# EAGLE design Mosfet (EAGLE 9.3.0)
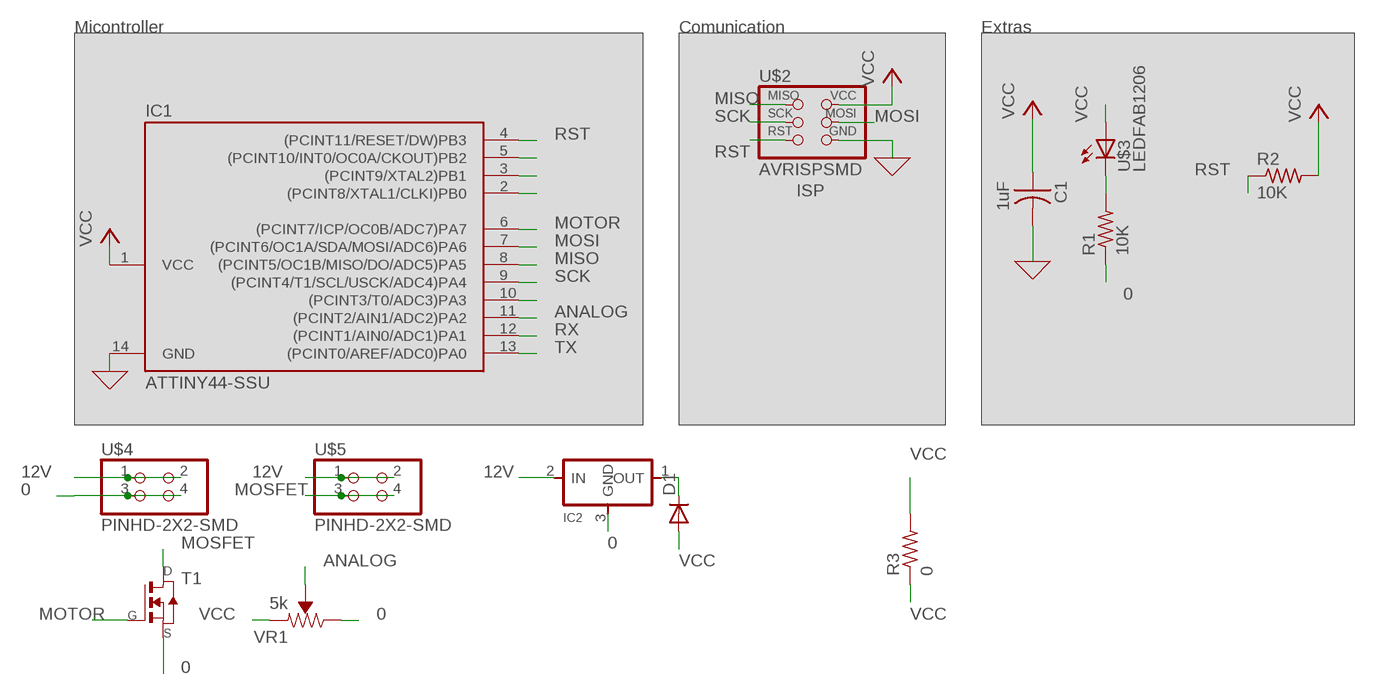
[diagram p0: schematic, sheet 1]

## Parts
C1  1uF  CAP-US1206FAB  [C1206FAB]
D1  DIODESOD123  [SOD123]
IC1  ATTINY44-SSU  [SOIC14]
IC2  REGULATORSOT23  [SOT23]
R1  10K  RES-US1206FAB  [R1206FAB]
R2  10K  RES-US1206FAB  [R1206FAB]
R3  0  RES-US1206FAB  [R1206FAB]
T1  NMOSFETSOT23  [SOT-23]
U$2  AVRISPSMD  [2X03SMD]
U$3  LEDFAB1206  [LED1206FAB]
U$4  PINHD-2X2-SMD  [2X02SMD]
U$5  PINHD-2X2-SMD  [2X02SMD]
VR1  5k  TRIMPOT-SMD-5MM-CLOSED-1/4W-20%  [TRIMPOT-SMD-5MM]

## Nets
0: C1.2 IC1.14(GND) IC2.3(GND) R1.1 T1.2(S) U$2.6(GND) U$4.3 U$4.4 VR1.C(CW) ; supply symbol labelled GND
12V: IC2.2(IN) U$4.1 U$4.2 U$5.1 U$5.2
ANALOG: IC1.11((PCINT2/AIN1/ADC2)PA2) VR1.B(WIPER)
MISO: IC1.8((PCINT5/OC1B/MISO/DO/ADC5)PA5) U$2.1(MISO)
MOSFET: T1.1(D) U$5.3 U$5.4
MOSI: IC1.7((PCINT6/OC1A/SDA/MOSI/ADC6)PA6) U$2.4(MOSI)
MOTOR: IC1.6((PCINT7/ICP/OC0B/ADC7)PA7) T1.3(G)
N$1: R1.2 U$3.2(C)
N$5: IC1.5((PCINT10/INT0/OC0A/CKOUT)PB2)
N$6: IC1.3((PCINT9/XTAL2)PB1)
N$7: IC1.2((PCINT8/XTAL1/CLKI)PB0)
N$11: D1.CATHODE(C) IC2.1(OUT)
N$12: IC1.10((PCINT3/T0/ADC3)PA3)
RST: IC1.4((PCINT11/RESET/DW)PB3) R2.1 U$2.5(RST)
RX: IC1.12((PCINT1/AIN0/ADC1)PA1)
SCK: IC1.9((PCINT4/T1/SCL/USCK/ADC4)PA4) U$2.3(SCK)
TX: IC1.13((PCINT0/AREF/ADC0)PA0)
VCC: C1.1 D1.ANODE(A) IC1.1(VCC) R2.2 R3.1 R3.2 U$2.2(VCC) U$3.1(A) VR1.A(CCW)

## Notes on the sheet
- Micontroller | Comunication | Extras
- ISP

## Library data of the parts
C1 = fab:CAP-US
D1 = fab:DIODE: DIODE high speed (Philips)
IC1 = fab:ATTINY44
IC2 = fab:REGULATOR
R1-R3 = fab:RES-US: Resistor (US Symbol) Variants with postfix FAB are widened to allow the routing of internal traces
T1 = fab:NMOSFET: MOS FET
U$2 = fab:AVRISP
U$3 = fab:LED: LED
U$4 U$5 = fab:PINHD-2X2-SMD
VR1 = SparkFun-Resistors:TRIMPOT: Trimming Potentiometer (Trimpot) Three-terminal potentiometers, with an adjustable wiper and two adjustable resistors. A pot can be used to create a configurable voltage divider, or as a variable resistor. "Trimpots" are a subset of potentiometers, usually intended for "set-and-forget" applications. They're often more delicate than standard potentiometers - rated for fewer turns. Variants PTH-KNOB - PTH Trimpot w/ finger-adjustable knob Trimpot 10K with Knob <https://www.sparkfun.com/products/9806> (COM-09806) Datasheet <http://www.sparkfun.com/datasheets/Components/General/TSR-3386.pdf> SMD-3MM-CLOSED-FRAME - SMD 3mm Square Closed-Frame Trimpot Used on e.g. EasyDriver - Stepper Motor Driver <https://www.sparkfun.com/products/12779> Datasheet <http://www.bitechnologies.com/pdfs/22.pdf> (22AR10KTR) SMD-5MM - SMD 5mm Square Closed-Frame Trimpot Used on e.g. IOIO-OTG - V2.2 <https://www.sparkfun.com/products/13613> Datasheet <http://www.vishay.com/docs/51008/ts53.pdf> (TS53YL502MR10) SMD-3MM-1/10W-25% - 3mm Square Open-Frame Trimpot Used on e.g. SparkFun Shapeoko <https://www.sparkfun.com/products/13899> Datasheet <http://www.bourns.com/docs/Product-Datasheets/TC33.pdf> (TC33X-2-103E); PROD_ID: RES-11156

## Board
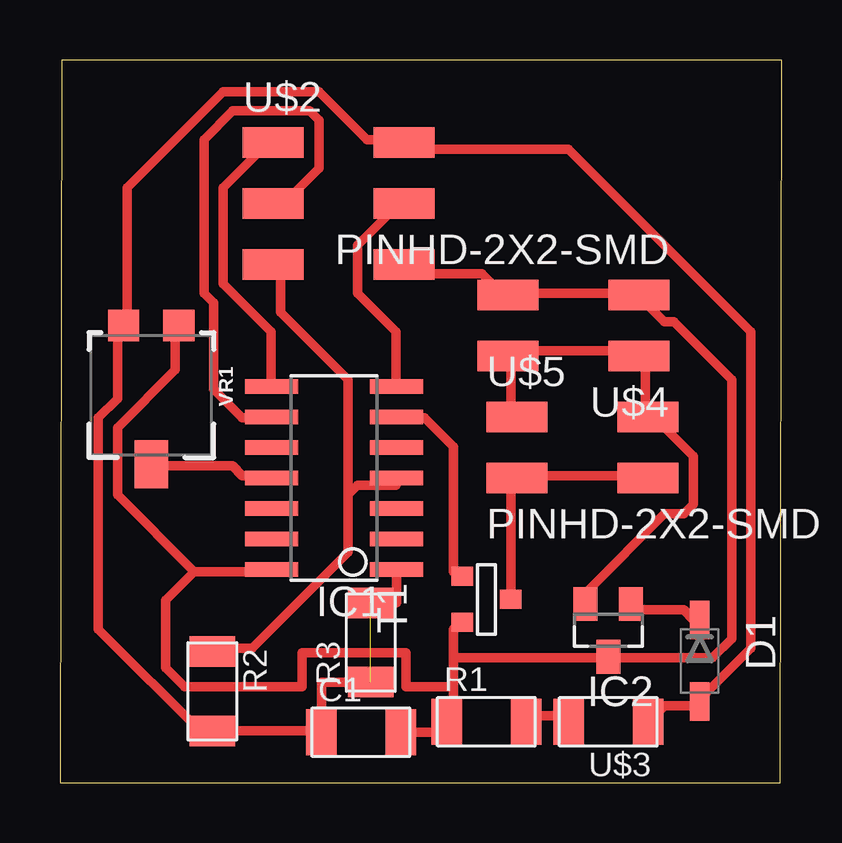
[diagram p1: board, top side]

Size 30.1 x 30.11 mm. Coordinates in mm from the lower left corner, seen from the top.
Outline: 0,0 30.02,0 30.1,30.11 0.08,30.11 0,0
Copper layers (1*16): Top 0.035mm / dielectric 1.5mm / Bottom 0.035mm
Design rules "default *": minimum track width 0.4mm, minimum drill 0.8mm, track to track 0.4mm, track to pad 0.4mm, pad to pad 0.4mm, via to via 0.4mm, smd to smd 0.4mm, copper to edge 40mil, drill to drill 6mil, minimum pad ring 10mil, minimum via ring 8mil, stop-mask expansion 4mil, vias tented up to drill 0mil, thermal gap 10mil

### Footprints (pad centres in the part's own frame; a part is rotated, then mirrored left to right if it is on the bottom)
C1206FAB = smd 1.27 x 1.905: 1 -1.651,0; 2 1.651,0
SOD123 = smd 1.6 x 0.8: ANODE 1.7,0; CATHODE -1.7,0
SOIC14 = smd 0.61 x 2.21: 1 -3.81,-2.603; 2 -2.54,-2.603; 3 -1.27,-2.603; 4 0,-2.603; 5 1.27,-2.603; 6 2.54,-2.603; 7 3.81,-2.603; 8 3.81,2.603; 9 2.54,2.603; 10 1.27,2.603; 11 0,2.603; 12 -1.27,2.603; 13 -2.54,2.603; 14 -3.81,2.603
SOT23 = smd 1 x 1.4: 1 -0.95,-1.1; 2 0.95,-1.1; 3 0,1.1
R1206FAB = smd 1.27 x 1.905: 1 -1.651,0; 2 1.651,0
SOT-23 = smd 0.787 x 0.889: 1 0.025,-1.016; 2 -0.94,1.016; 3 0.991,1.016
2X03SMD = smd 2.54 x 1.27: 1 -2.54,2.54; 2 2.92,2.54; 3 -2.54,0; 4 2.92,0; 5 -2.54,-2.54; 6 2.92,-2.54
LED1206FAB = smd 1.27 x 1.905: 1 -1.651,0; 2 1.651,0
2X02SMD = smd 2.54 x 1.27: 1 -2.54,1.27; 2 2.92,1.27; 3 -2.54,-1.27; 4 2.92,-1.27
TRIMPOT-SMD-5MM = smd 1.3 x 1.3: A 1.15,-2.54; C -1.15,-2.54 | smd 1.402 x 2: B 0,3.239

### Placement (x,y rotation side)
C1  12.55,2.11 0 top
D1  26.67,5.08 270 top
IC1  11.43,12.7 90 top
IC2  22.86,6.35 180 top
R1  17.78,2.54 0 top
R2  6.35,3.81 270 top
R3  12.95,5.84 90 top
T1  17.78,7.62 90 top
U$2  11.43,24.13 0 top
U$3  22.86,2.54 180 top
U$4  21.59,19.05 180 top
U$5  21.59,13.97 0 top
VR1  3.81,16.51 180 top

### Tracks (layer width: path | path; a pad name or v marks a point on that pad's centre or on a via)
0
  Top 0.4: U$2.6 14.4,21.2 17.6,21.2 18.4,20.4 U$4.4 18.8,20.4 24,20.4 U$4.3 24.4,20 25.2,19.2 25.6,19.2 28,16.8 28,6 27.2,5.2 23.2,5.2 IC2.3 22.8,5.2 16.4,5.2 | 16.4,4 16.4,2.8 R1.1 16.13,2.11 C1.2 | 16.4,5.2 16.4,6.4 T1.2 | 5.6,8.8 2.4,12 2.4,14.8 4.8,17.2 4.8,18.8 VR1.C | 5.6,8.8 8.8,8.8 IC1.14 | 5.6,8.8 4.4,7.6 4.4,4.8 5.2,4 10.1,4 10.1,5.43 14.43,5.43 14.43,4 16.4,4 | 16.4,4 16.4,5.2
12V
  Top 0.4: U$5.1 18.8,15.6 18.8,17.6 U$4.2 18.8,18 24,18 U$4.1 24.4,17.6 24.4,15.6 U$5.2 24.8,15.2 26.4,13.6 26.4,11.6 26,11.2 25.2,11.2 22,8 22,7.6 IC2.2
ANALOG
  Top 0.4: VR1.B 4,13.2 7.2,13.2 7.6,12.8 8.8,12.8 IC1.11
MISO
  Top 0.4: IC1.8 8.8,16.8 8.8,18.8 6.8,20.8 6.8,24.8 8.8,26.8 U$2.1
MOSFET
  Top 0.4: T1.1 18.8,8 18.8,12.4 U$5.3 19.2,12.8 24.4,12.8 U$5.4
MOSI
  Top 0.4: IC1.7 14,16.8 14,18.8 12.4,20.4 12.4,22.4 14,24 U$2.4
MOTOR
  Top 0.4: T1.3 16.4,8.8 16.4,14 15.2,15.2 14.4,15.2 IC1.6
N$1
  Top 0.4: R1.2 19.6,2.8 21.2,2.8 U$3.2
N$11
  Top 0.4: IC2.1 24,7.2 26,7.2 26.4,6.8 D1.CATHODE
RST
  Top 0.4: 12,12 12,9.6 8,5.6 6.4,5.6 R2.1 | 12,12 12.4,12.4 14,12.4 IC1.4 | 12,12 12,16.8 9.2,19.6 9.2,21.2 U$2.5
SCK
  Top 0.4: IC1.9 8.8,15.2 7.6,15.2 6.4,16.4 6.4,20 6,20.4 6,26.8 7.2,28 10.4,28 10.8,27.6 10.8,25.6 9.2,24 U$2.3
VCC  (1 unrouted)
  Top 0.4: U$3.1 24.8,2.8 25.2,3.2 26.4,3.2 D1.ANODE 26.8,3.6 28.8,5.6 28.8,18.8 21.2,26.4 14.4,26.4 U$2.2 14,26.8 12.8,26.8 10.8,28.8 6.8,28.8 2.8,24.8 2.8,19.2 VR1.A 2.4,18.8 2.4,16 1.6,15.2 1.6,6.4 6,2 R2.2 | 7.2,2.4 6.4,2.4 R2.2 | R2.2 10.85,2.16 C1.1 10.9,4.19 R3.1 | R3.2 14.03,7.49 IC1.1